# EAGLE design remoteReceive (EAGLE 9.6.2)
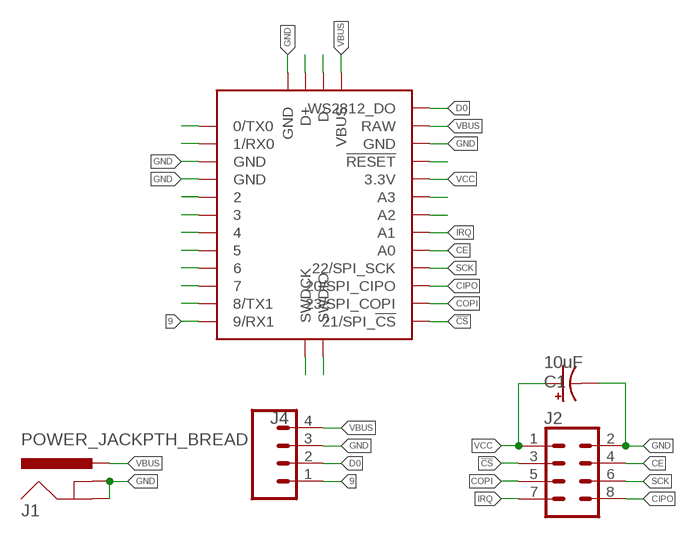
[diagram p0: schematic, sheet 1]

## Parts
C1  10uF  10UF-POLAR-RADIAL-2.5MM-KIT-25V-20%  [CPOL-RADIAL-2.5MM-5MM-KIT]
J1  POWER_JACKPTH_BREAD  [POWER_JACK_PTH_BREAD]
J2  CONN_04X2  [2X4]
J4  CONN_04POLAR  [MOLEX-1X4]
U$1  SF17717_PROMICRORP2040_BREAKOUT  [SF17717_PROMICRORP2040_BREAKOUT]

## Nets
9: J4.1 U$1.01L(9/RX1) U$1.01L_PADB(9/RX1) U$1.01L_PADT(9/RX1)
!CS: J2.3 U$1.12R(21/SPI_!CS) U$1.12R_PADB(21/SPI_!CS) U$1.12R_PADT(21/SPI_!CS)
CE: J2.4 U$1.08R(A0) U$1.08R_PADB(A0) U$1.08R_PADT(A0)
CIPO: J2.8 U$1.10R(20/SPI_CIPO) U$1.10R_PADB(20/SPI_CIPO) U$1.10R_PADT(20/SPI_CIPO)
COPI: J2.5 U$1.11R(23/SPI_COPI) U$1.11R_PADB(23/SPI_COPI) U$1.11R_PADT(23/SPI_COPI)
D0: J4.2 U$1.D0_B(WS2812_DO) U$1.D0_T(WS2812_DO)
GND: C1.2(-) J1.GND J1.GNDBREAK J2.2 J4.3 U$1.02R(GND) U$1.02R_PADB(GND) U$1.02R_PADT(GND) U$1.09L(GND) U$1.09L_PADB(GND) U$1.09L_PADT(GND) U$1.10L(GND) U$1.10L_PADB(GND) U$1.10L_PADT(GND) U$1.GND_B(GND) U$1.GND_T(GND)
IRQ: J2.7 U$1.07R(A1) U$1.07R_PADB(A1) U$1.07R_PADT(A1)
N$1: U$1.12L(0/TX0) U$1.12L_PADB(0/TX0) U$1.12L_PADT(0/TX0)
N$2: U$1.11L(1/RX0) U$1.11L_PADB(1/RX0) U$1.11L_PADT(1/RX0)
N$3: U$1.SWDCK_B(SWDCK) U$1.SWDCK_T(SWDCK)
N$4: U$1.SWDIO_B(SWDIO) U$1.SWDIO_T(SWDIO)
N$5: U$1.D+_B(D+) U$1.D+_T(D+)
N$6: U$1.06L U$1.06L_PADB U$1.06L_PADT
N$7: U$1.05L U$1.05L_PADB U$1.05L_PADT
N$8: U$1.04L U$1.04L_PADB U$1.04L_PADT
N$9: U$1.03L U$1.03L_PADB U$1.03L_PADT
N$11: U$1.D-_B(D-) U$1.D-_T(D-)
N$15: U$1.03R(!RESET) U$1.03R_PADB(!RESET) U$1.03R_PADT(!RESET)
N$16: U$1.05R(A3) U$1.05R_PADB(A3) U$1.05R_PADT(A3)
N$17: U$1.06R(A2) U$1.06R_PADB(A2) U$1.06R_PADT(A2)
N$27: U$1.02L(8/TX1) U$1.02L_PADB(8/TX1) U$1.02L_PADT(8/TX1)
SCK: J2.6 U$1.09R(22/SPI_SCK) U$1.09R_PADB(22/SPI_SCK) U$1.09R_PADT(22/SPI_SCK)
SCL_1: U$1.08L U$1.08L_PADB U$1.08L_PADT
SDA_1: U$1.07L U$1.07L_PADB U$1.07L_PADT
VBUS: J1.PWR J4.4 U$1.01R(RAW) U$1.01R_PADB(RAW) U$1.01R_PADT(RAW) U$1.VBUS_B(VBUS) U$1.VBUS_T(VBUS)
VCC: C1.1(+) J2.1 U$1.04R(3.3V) U$1.04R_PADB(3.3V) U$1.04R_PADT(3.3V)

## Library data of the parts
C1 = SparkFun-Capacitors:10UF-POLAR: 10.0µF polarized capacitors A capacitor is a passive two-terminal electrical component used to store electrical energy temporarily in an electric field.; PROD_ID: CAP-08440
J1 = SparkFun-Connectors:POWER_JACK: Power Jack Connector This is the standard 5.5mm barrel jack for power. The PTH is the most common, proven, reliable, footprint. The Slot footprint only works if the mill layer is transmitted to the PCB fab house so be warned. Here are the connectors we sell at SparkFun: DC Barrel Power Jack/Connector <https://www.sparkfun.com/products/119> (PRT-00119) DC Barrel Power Jack/Connector (SMD) <https://www.sparkfun.com/products/12748> (PRT-12748) DC Barrel Jack Adapter - Breadboard Compatible <https://www.sparkfun.com/products/10811> (PRT-10811) It is used on this SparkFun product (and many, many others): SparkFun RedBoard - Programmed with Arduino <https://www.sparkfun.com/products/12757> (DEV-12757) Also, if you need a mating power supply or connector, please check these out: Wall Adapter Power Supply - 9VDC 650mA <https://www.sparkfun.com/products/298> (TOL-00298) DC Barrel Jack Adapter - Male <https://www.sparkfun.com/products/10287> (PRT-10287); PROD_ID: COMP-13253
J2 = SparkFun-Connectors:CONN_04X2: Multi connection point. Often used as Generic Header-pin footprint for 0.1 inch spaced/style header connections On any of the 0.1 inch spaced packages, you can populate with these: Break Away Headers - Straight <https://www.sparkfun.com/products/116> (PRT-00116) Break Away Male Headers - Right Angle <https://www.sparkfun.com/products/553> (PRT-00553) Female Headers <https://www.sparkfun.com/products/115> (PRT-00115) Break Away Headers - Machine Pin <https://www.sparkfun.com/products/117> (PRT-00117) Break Away Female Headers - Swiss Machine Pin <https://www.sparkfun.com/products/743> (PRT-00743)
J4 = SparkFun-Connectors:CONN_04: Multi connection point. Often used as Generic Header-pin footprint for 0.1 inch spaced/style header connections On any of the 0.1 inch spaced packages, you can populate with these: Break Away Headers - Straight <https://www.sparkfun.com/products/116> (PRT-00116) Break Away Male Headers - Right Angle <https://www.sparkfun.com/products/553> (PRT-00553) Female Headers <https://www.sparkfun.com/products/115> (PRT-00115) Break Away Headers - Machine Pin <https://www.sparkfun.com/products/117> (PRT-00117) Break Away Female Headers - Swiss Machine Pin <https://www.sparkfun.com/products/743> (PRT-00743) For SCREWTERMINALS and SPRING TERMINALS visit here: Screw Terimnals on SparkFun.com <https://www.sparkfun.com/search/results?term=Screw+Terminals> (5mm/3.5mm/2.54mm spacing) This device is also useful as a general connection point to wire up your design to another part of your project. Our various solder wires solder well into these plated through hole pads. Hook-Up Wire - Assortment (Stranded, 22 AWG) <https://www.sparkfun.com/products/11375> (PRT-11375) Hook-Up Wire - Assortment (Solid Core, 22 AWG) <https://www.sparkfun.com/products/11367> (PRT-11367) View the entire wire category on our website here <https://www.sparkfun.com/categories/141> Special notes: Molex polarized connector foot print use with SKU : PRT-08231 with associated crimp pins and housings. 1MM SMD Version SKU: PRT-10208; PROD_ID: CONN-08186; SF_ID: PRT-08231
U$1 = nm3210_custom:SF17717_PROMICRORP2040_BREAKOUT: Sparkfun Pro Micro RP2040 (DEV-17717) Breakout. Layout of the Pro Micro board to allow for easy castellated soldering.

## Board
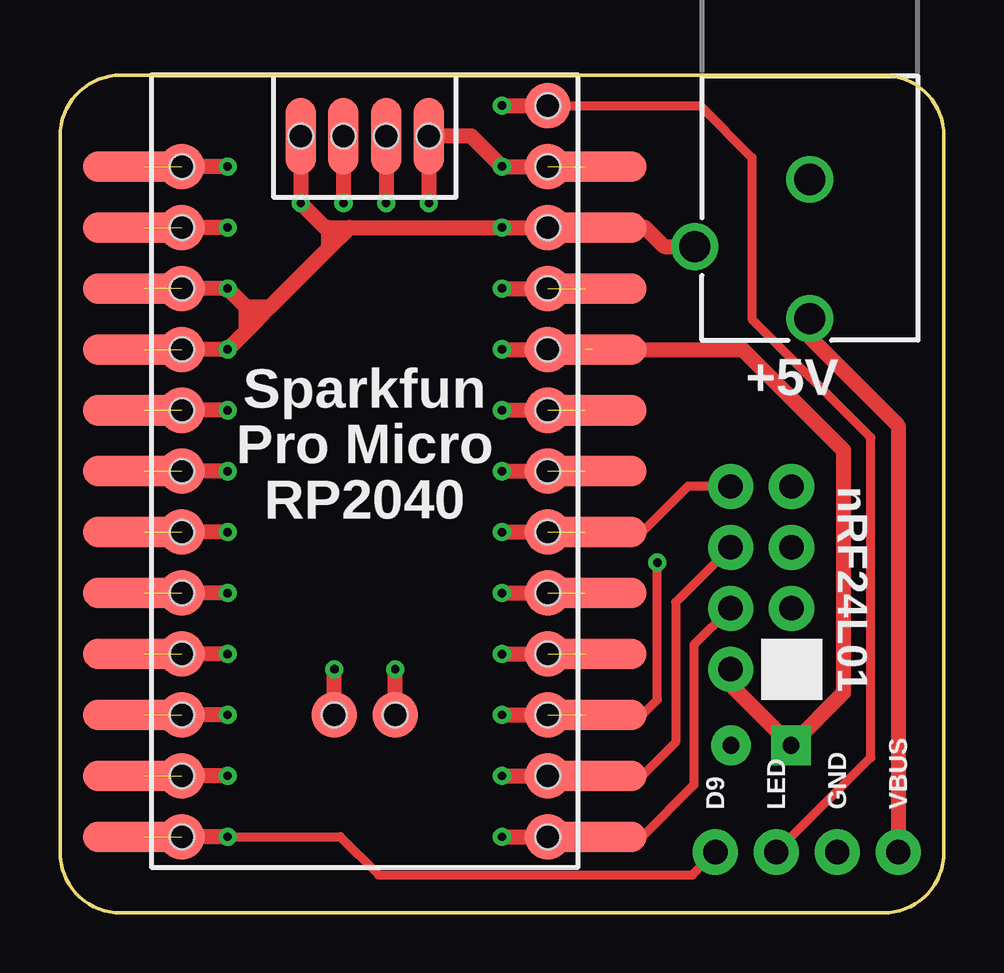
[diagram p1: board, top side]
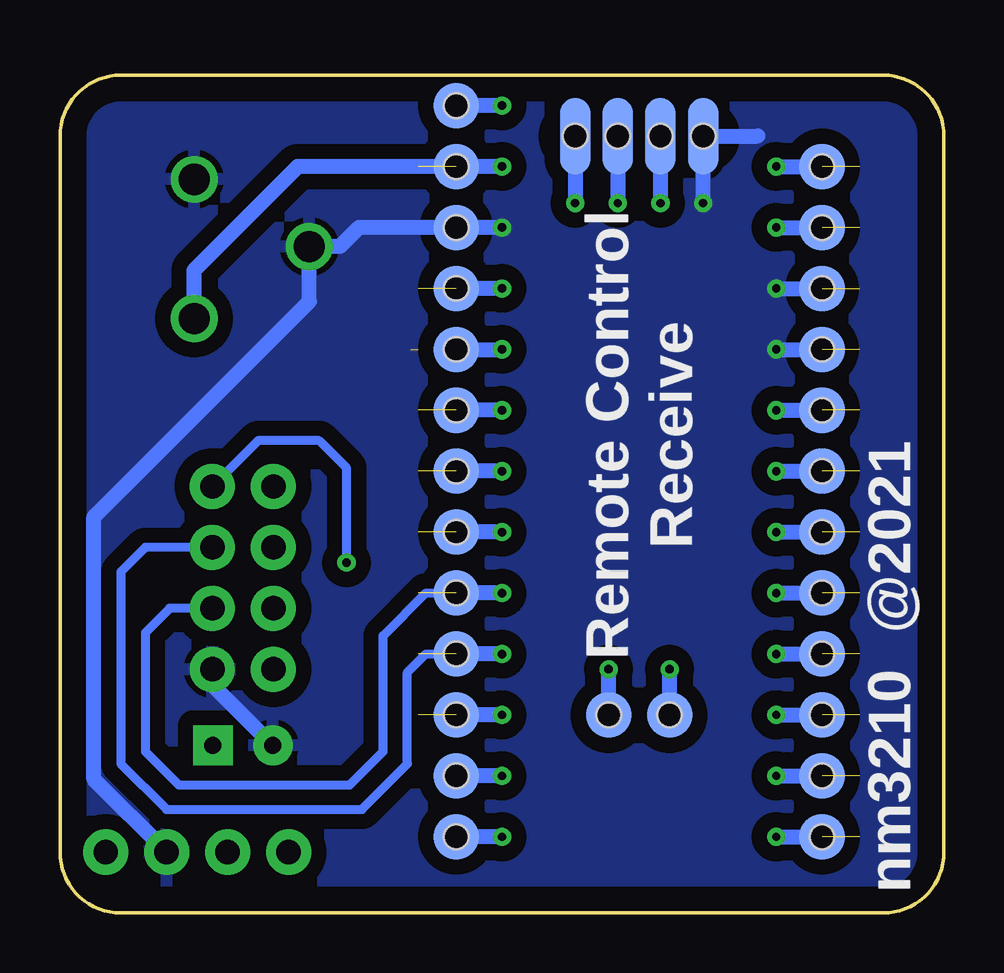
[diagram p2: board, bottom side, seen from below]

Size 36.83 x 34.92 mm. Coordinates in mm from the lower left corner, seen from the top.
Outline: 0,32.38 0,2.54 arc90 2.54,0 34.29,0 arc90 36.83,2.54 36.83,32.38 arc90 34.29,34.92 2.54,34.92 arc90 0,32.38
Copper layers (1*16): Top 0.035mm / dielectric 1.5mm / Bottom 0.035mm
Design rules "default": minimum track width 6mil, minimum drill 0.35mm, track to track 6mil, track to pad 6mil, pad to pad 6mil, via to via 6mil, smd to smd 6mil, copper to edge 40mil, drill to drill 6mil, minimum pad ring 10mil, minimum via ring 8mil, stop-mask expansion 4mil, vias tented up to drill 0mil, thermal gap 10mil

### Footprints (pad centres in the part's own frame; a part is rotated, then mirrored left to right if it is on the bottom)
CPOL-RADIAL-2.5MM-5MM-KIT = drill 0.7 pad 1.651 square: 1 1.25,0 | drill 0.7 pad 1.651: 2 -1.25,0
POWER_JACK_PTH_BREAD = drill 1.3: GND 0,7.9; GNDBREAK 4.8,10.7; PWR 0,13.7
2X4 = drill 1.016 pad 1.88: 1 -3.81,-1.27; 2 -3.81,1.27; 3 -1.27,-1.27; 4 -1.27,1.27; 5 1.27,-1.27; 6 1.27,1.27; 7 3.81,-1.27; 8 3.81,1.27
MOLEX-1X4 = drill 1.016 pad 1.88: 1 0,0; 2 2.54,0; 3 5.08,0; 4 7.62,0
SF17717_PROMICRORP2040_BREAKOUT = smd 5.08 x 1.27: 01L -0.305,1.27; 01R 18.085,29.21; 02L -0.305,3.81; 02R 18.085,26.67; 03L -0.305,6.35; 03R 18.085,24.13; 04L -0.305,8.89; 04R 18.085,21.59; 05L -0.305,11.43; 05R 18.085,19.05; 06L -0.305,13.97; 06R 18.085,16.51; 07L -0.305,16.51; 07R 18.085,13.97; 08L -0.305,19.05; 08R 18.085,11.43; 09L -0.305,21.59; 09R 18.085,8.89; 10L -0.305,24.13; 10R 18.085,6.35; 11L -0.305,26.67; 11R 18.085,3.81; 12L -0.305,29.21; 12R 18.085,1.27 | smd 1.905 x 1.905 bottom: 01L_PADB 1.27,1.27; 01R_PADB 16.51,29.21; 02L_PADB 1.27,3.81; 02R_PADB 16.51,26.67; 03L_PADB 1.27,6.35; 03R_PADB 16.51,24.13; 04L_PADB 1.27,8.89; 04R_PADB 16.51,21.59; 05L_PADB 1.27,11.43; 05R_PADB 16.51,19.05; 06L_PADB 1.27,13.97; 06R_PADB 16.51,16.51; 07L_PADB 1.27,16.51; 07R_PADB 16.51,13.97; 08L_PADB 1.27,19.05; 08R_PADB 16.51,11.43; 09L_PADB 1.27,21.59; 09R_PADB 16.51,8.89; 10L_PADB 1.27,24.13; 10R_PADB 16.51,6.35; 11L_PADB 1.27,26.67; 11R_PADB 16.51,3.81; 12L_PADB 1.27,29.21; 12R_PADB 16.51,1.27; D0_B 16.51,31.75; SWDCK_B 7.62,6.35; SWDIO_B 10.16,6.35 | smd 1.905 x 1.905: 01L_PADT 1.27,1.27; 01R_PADT 16.51,29.21; 02L_PADT 1.27,3.81; 02R_PADT 16.51,26.67; 03L_PADT 1.27,6.35; 03R_PADT 16.51,24.13; 04L_PADT 1.27,8.89; 04R_PADT 16.51,21.59; 05L_PADT 1.27,11.43; 05R_PADT 16.51,19.05; 06L_PADT 1.27,13.97; 06R_PADT 16.51,16.51; 07L_PADT 1.27,16.51; 07R_PADT 16.51,13.97; 08L_PADT 1.27,19.05; 08R_PADT 16.51,11.43; 09L_PADT 1.27,21.59; 09R_PADT 16.51,8.89; 10L_PADT 1.27,24.13; 10R_PADT 16.51,6.35; 11L_PADT 1.27,26.67; 11R_PADT 16.51,3.81; 12L_PADT 1.27,29.21; 12R_PADT 16.51,1.27; D0_T 16.51,31.75; SWDCK_T 7.62,6.35; SWDIO_T 10.16,6.35 | smd 1.27 x 3.175 bottom: D+_B 8.001,30.48; D-_B 9.779,30.48; GND_B 6.223,30.48; VBUS_B 11.557,30.48 | smd 1.27 x 3.175: D+_T 8.001,30.48; D-_T 9.779,30.48; GND_T 6.223,30.48; VBUS_T 11.557,30.48 | hole 1.016: 16.51,29.21; 16.51,26.67; 16.51,24.13; 16.51,21.59; 16.51,19.05; 16.51,16.51; 16.51,13.97; 16.51,11.43; 16.51,8.89; 16.51,6.35; 16.51,3.81; 16.51,1.27; 1.27,1.27; 1.27,3.81; 1.27,6.35; 1.27,8.89; 1.27,11.43; 1.27,13.97; 1.27,16.51; 1.27,19.05; 1.27,21.59; 1.27,24.13; 1.27,26.67; 1.27,29.21; 7.62,6.35; 10.16,6.35; 16.51,31.75; 6.223,30.48; 8.001,30.48; 9.779,30.48; 11.557,30.48

### Placement (x,y rotation side)
C1  29.21,6.99 0 top
J1  31.24,38.48 180 top
J2  29.21,13.97 90 bottom
J4  27.3,2.54 0 top
U$1  3.81,1.91 0 top

### Tracks (layer width: path | path; a pad name or v marks a point on that pad's centre or on a via)
9  (via drill 0.35)  (1 unrouted)
  Top 0.381: v6.99,3.17 11.68,3.17 13.27,1.59 26.35,1.59 J4.1
  Top 0.635: v6.99,3.17 U$1.01L_PADT
  Bottom 0.635: v6.99,3.17 U$1.01L_PADT
!CS  (via drill 0.35)
  Top 0.381: U$1.12R U$1.12R_PADB | J2.3 26.42,11.18 26.42,5.33 24.26,3.17 v18.41,3.17
  Top 0.635: v18.41,3.17 U$1.12R_PADB
  Bottom 0.635: v18.41,3.17 U$1.12R_PADB
CE  (via drill 0.35)  (1 unrouted)
  Top 0.635: v18.41,13.34 U$1.08R_PADB
  Bottom 0.381: J2.4 32.26,12.7 33.27,11.68 33.27,6.73 31.88,5.33 24.77,5.33 23.37,6.73 23.37,11.56 21.59,13.34 U$1.08R_PADB
  Bottom 0.635: v18.41,13.34 U$1.08R_PADB
CIPO  (via drill 0.35)  (1 unrouted)
  Top 0.381: U$1.10R 24.26,8.26 24.89,8.89 v24.89,14.61
  Top 0.635: v18.41,8.26 U$1.10R_PADT
  Bottom 0.381: v24.89,14.61 24.89,18.54 26.04,19.68 28.57,19.68 J2.8
  Bottom 0.635: v18.41,8.26 U$1.10R_PADT
COPI  (via drill 0.35)
  Top 0.381: U$1.11R_PADT U$1.11R 24.26,5.71 25.65,7.11 25.65,12.95 J2.5
  Top 0.635: v18.41,5.71 U$1.11R_PADT
  Bottom 0.635: v18.41,5.71 U$1.11R_PADT
D0  (via drill 0.35)
  Top 0.381: J4.2 33.78,6.48 33.78,19.81 28.83,24.77 28.83,31.5 26.67,33.66 v18.41,33.66
  Top 0.635: v18.41,33.66 U$1.D0_B
  Bottom 0.635: v18.41,33.66 U$1.D0_B
GND  (via drill 0.35)  (2 unrouted)
  Top 0.635: 10.03,33.08 U$1.GND_B v10.03,29.59 11.05,28.57 11.18,28.57 | U$1.09L_PADT v6.99,23.5 8.26,24.77 | U$1.10L_PADT v6.99,26.04 7.75,25.27 | v18.41,28.57 U$1.02R_PADT | v18.41,28.57 U$1.02R | v18.41,28.57 24.38,28.57 25.17,27.78 J1.GNDBREAK | 8.26,24.77 8.76,25.27 | 8.76,25.27 11.18,27.69 | 11.18,27.69 12.06,28.57 | 7.75,25.27 8.26,24.77 | 7.75,25.27 7.75,24.38 | 7.75,25.27 8.76,25.27 | 11.18,28.57 v18.41,28.57 | 11.18,28.57 11.18,27.69
  Bottom 0.635: v6.99,26.04 U$1.10L_PADT | v6.99,23.5 U$1.09L_PADT | v10.03,29.59 U$1.GND_B 7.75,32.38 | U$1.02R_PADT v18.41,28.57 24.38,28.57 25.17,27.78 J1.GNDBREAK 26.44,25.49 35.42,16.51 35.42,5.58 J4.3 | C1.2 30.48,9.51 J2.2
  pour Bottom (isolate 0.635): 0,34.92 36.83,34.92 36.83,0 0,0
IRQ  (via drill 0.35)  (1 unrouted)
  Top 0.381: U$1.07R 24.26,15.88 26.16,17.78 J2.7
  Top 0.635: v18.41,15.88 U$1.07R_PADT
  Bottom 0.635: v18.41,15.88 U$1.07R_PADT
N$1  (via drill 0.35)  (1 unrouted)
  Top 0.635: v6.99,31.11 U$1.12L_PADT
  Bottom 0.635: v6.99,31.11 U$1.12L_PADT
N$2  (via drill 0.35)  (1 unrouted)
  Top 0.635: v6.99,28.57 U$1.11L_PADB
  Bottom 0.635: v6.99,28.57 U$1.11L_PADB
N$3  (via drill 0.35)
  Top 0.635: U$1.SWDCK_B v11.43,10.16
  Bottom 0.635: U$1.SWDCK_B v11.43,10.16
N$4  (via drill 0.35)
  Top 0.635: U$1.SWDIO_T v13.97,10.16
  Bottom 0.635: U$1.SWDIO_T v13.97,10.16
N$5  (via drill 0.35)
  Top 0.635: U$1.D+_T v11.81,29.59
  Bottom 0.635: U$1.D+_T v11.81,29.59
N$6  (via drill 0.35)  (1 unrouted)
  Top 0.635: v6.99,15.88 U$1.06L_PADB
  Bottom 0.635: v6.99,15.88 U$1.06L_PADB
N$7  (via drill 0.35)  (1 unrouted)
  Top 0.635: v6.99,13.34 U$1.05L_PADB
  Bottom 0.635: v6.99,13.34 U$1.05L_PADB
N$8  (via drill 0.35)  (1 unrouted)
  Top 0.635: v6.99,10.79 U$1.04L_PADB
  Bottom 0.635: v6.99,10.79 U$1.04L_PADB
N$9  (via drill 0.35)  (1 unrouted)
  Top 0.635: v6.99,8.26 U$1.03L_PADB
  Bottom 0.635: v6.99,8.26 U$1.03L_PADB
N$11  (via drill 0.35)
  Top 0.635: U$1.D-_T v13.59,29.59
  Bottom 0.635: U$1.D-_T v13.59,29.59
N$15  (via drill 0.35)  (1 unrouted)
  Top 0.635: v18.41,26.04 U$1.03R_PADT
  Bottom 0.635: v18.41,26.04 U$1.03R_PADT
N$16  (via drill 0.35)  (1 unrouted)
  Top 0.635: v18.41,20.95 U$1.05R_PADT
  Bottom 0.635: v18.41,20.95 U$1.05R_PADT
N$17  (via drill 0.35)  (1 unrouted)
  Top 0.635: v18.41,18.41 U$1.06R_PADB
  Bottom 0.635: v18.41,18.41 U$1.06R_PADB
N$27  (via drill 0.35)  (1 unrouted)
  Top 0.635: v6.99,5.71 U$1.02L_PADB
  Bottom 0.635: v6.99,5.71 U$1.02L_PADB
SCK  (via drill 0.35)  (1 unrouted)
  Top 0.635: v18.41,10.79 U$1.09R_PADB
  Bottom 0.381: J2.6 33.27,15.24 34.29,14.22 34.29,6.22 32.38,4.32 24.26,4.32 22.35,6.22 22.35,10.03 21.59,10.79 U$1.09R_PADB
  Bottom 0.635: v18.41,10.79 U$1.09R_PADB
SCL_1  (via drill 0.35)  (1 unrouted)
  Top 0.635: v6.99,20.95 U$1.08L_PADT
  Bottom 0.635: v6.99,20.95 U$1.08L_PADT
SDA_1  (via drill 0.35)  (1 unrouted)
  Top 0.635: v6.99,18.41 U$1.07L_PADB
  Bottom 0.635: v6.99,18.41 U$1.07L_PADB
VBUS  (via drill 0.35)  (1 unrouted)
  Top 0.635: U$1.01R_PADT v18.41,31.11 17.14,32.38 U$1.VBUS_T v15.37,29.59 | J1.PWR 31.24,24 34.92,20.32 J4.4
  Bottom 0.635: U$1.01R_PADT v18.41,31.11 26.92,31.11 31.24,26.8 J1.PWR | U$1.VBUS_T v15.37,29.59
VCC  (via drill 0.35)  (1 unrouted)
  Top 0.635: v18.41,23.5 U$1.04R_PADT | v18.41,23.5 22.23,23.5 | v18.41,23.5 28.45,23.5 32.64,19.3 32.64,9.16 C1.1 27.94,9.51 J2.1
  Bottom 0.635: U$1.04R_PADT v18.41,23.5

### Text on the board
tPlace: +5V | Sparkfun / Pro Micro / RP2040 | nRF24L01 | D9 | LED | GND | VBUS
bPlace: @2021 | Remote Control / Receive | nm3210